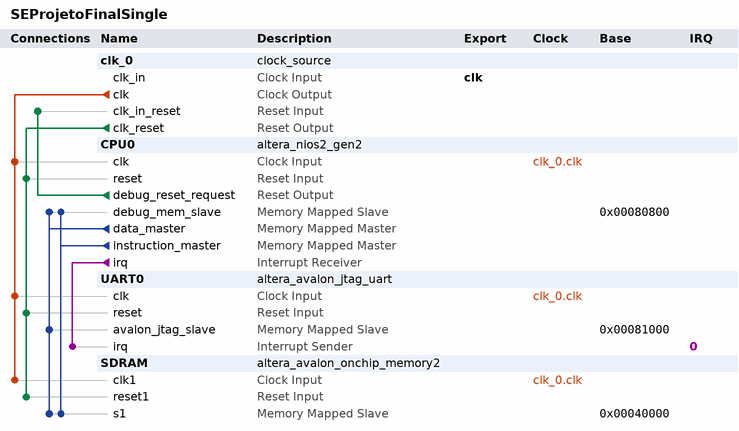
[diagram p0: system contents]
# Platform Designer (Qsys) system SEProjetoFinalSingle, Cyclone IV E EP4CE115F29C7
# Parameters at their usual value, and those the tool derives, are not listed.
package require -exact qsys 21.1
create_system SEProjetoFinalSingle
set_project_property DEVICE_FAMILY {Cyclone IV E}
set_project_property DEVICE EP4CE115F29C7

add_instance clk_0 clock_source 21.1
set_instance_parameter_value clk_0 clockFrequency 50000000

add_instance CPU0 altera_nios2_gen2 21.1
set_instance_parameter_value CPU0 dcache_size 2048
set_instance_parameter_value CPU0 exceptionSlave SDRAM.s1
set_instance_parameter_value CPU0 icache_size 4096
set_instance_parameter_value CPU0 impl Fast
set_instance_parameter_value CPU0 resetSlave SDRAM.s1

add_instance UART0 altera_avalon_jtag_uart 21.1
set_instance_parameter_value UART0 simInteractiveOptions NO_INTERACTIVE_WINDOWS

add_instance SDRAM altera_avalon_onchip_memory2 21.1
set_instance_parameter_value SDRAM dataWidth 32
set_instance_parameter_value SDRAM dualPort false
set_instance_parameter_value SDRAM initMemContent true
set_instance_parameter_value SDRAM initializationFileName onchip_mem.hex
set_instance_parameter_value SDRAM memorySize 262144

# connections
add_connection clk_0.clk CPU0.clk clock
add_connection clk_0.clk SDRAM.clk1 clock
add_connection clk_0.clk UART0.clk clock
add_connection clk_0.clk_reset CPU0.reset reset
add_connection clk_0.clk_reset SDRAM.reset1 reset
add_connection clk_0.clk_reset UART0.reset reset
add_connection CPU0.debug_reset_request clk_0.clk_in_reset reset
add_connection CPU0.data_master CPU0.debug_mem_slave avalon
set_connection_parameter_value CPU0.data_master/CPU0.debug_mem_slave baseAddress 0x00080800
add_connection CPU0.data_master SDRAM.s1 avalon
set_connection_parameter_value CPU0.data_master/SDRAM.s1 baseAddress 0x00040000
add_connection CPU0.data_master UART0.avalon_jtag_slave avalon
set_connection_parameter_value CPU0.data_master/UART0.avalon_jtag_slave baseAddress 0x00081000
add_connection CPU0.instruction_master CPU0.debug_mem_slave avalon
set_connection_parameter_value CPU0.instruction_master/CPU0.debug_mem_slave baseAddress 0x00080800
add_connection CPU0.instruction_master SDRAM.s1 avalon
set_connection_parameter_value CPU0.instruction_master/SDRAM.s1 baseAddress 0x00040000
add_connection CPU0.irq UART0.irq interrupt
set_connection_parameter_value CPU0.irq/UART0.irq irqNumber 0

# exported interfaces
add_interface clk clock sink
set_interface_property clk EXPORT_OF clk_0.clk_in

set_interconnect_requirement {$system} qsys_mm.clockCrossingAdapter HANDSHAKE
set_interconnect_requirement {$system} qsys_mm.enableEccProtection FALSE
set_interconnect_requirement {$system} qsys_mm.insertDefaultSlave FALSE
set_interconnect_requirement {$system} qsys_mm.maxAdditionalLatency 1

save_system SEProjetoFinalSingle.qsys
